# EAGLE design STM32F446RC_single layer V2_labelled (EAGLE 9.2.0)
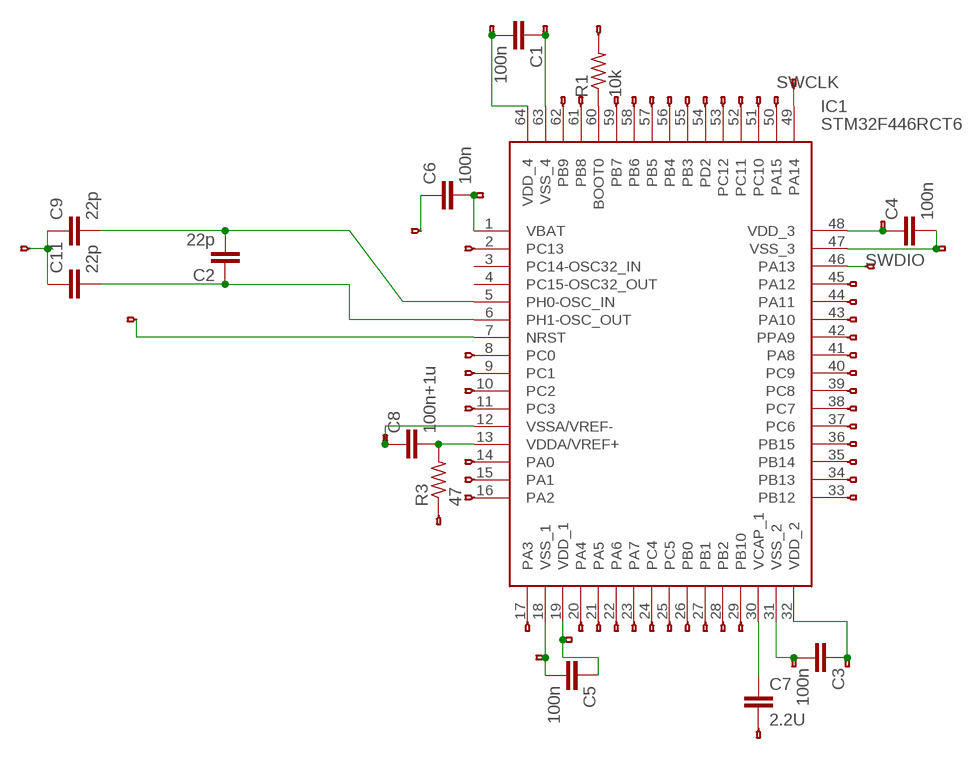
[diagram p0: schematic, sheet 1]

## Parts
C1  100n  C2,5-3  [C2.5-3]
C2  22p  C2,5-3  [C2.5-3]
C3  100n  C2,5-3  [C2.5-3]
C4  100n  C2,5-3  [C2.5-3]
C5  100n  C2,5-3  [C2.5-3]
C6  100n  C2,5-3  [C2.5-3]
C7  2.2U  C2,5-3  [C2.5-3]
C8  100n+1u  C2,5-3  [C2.5-3]
C9  22p  C2,5-3  [C2.5-3]
C11  22p  C2,5-3  [C2.5-3]
IC1  STM32F446RCT6  [QFP50P1200X1200X160-64N]
JP1  HEADERHOLE-HEADERHOLE  [1X1-HEADER-HOLE]
JP2  HEADERHOLE-HEADERHOLE  [1X1-HEADER-HOLE]
JP3  HEADERHOLE-HEADERHOLE  [1X1-HEADER-HOLE]
JP4  HEADERHOLE-HEADERHOLE  [1X1-HEADER-HOLE]
JP5  HEADERHOLE-HEADERHOLE  [1X1-HEADER-HOLE]
JP6  HEADERHOLE-HEADERHOLE  [1X1-HEADER-HOLE]
JP7  HEADERHOLE-HEADERHOLE  [1X1-HEADER-HOLE]
JP9  HEADERHOLE-HEADERHOLE  [1X1-HEADER-HOLE]
JP10  HEADERHOLE-HEADERHOLE  [1X1-HEADER-HOLE]
JP11  HEADERHOLE-HEADERHOLE  [1X1-HEADER-HOLE]
JP12  HEADERHOLE-HEADERHOLE  [1X1-HEADER-HOLE]
JP13  HEADERHOLE-HEADERHOLE  [1X1-HEADER-HOLE]
JP14  HEADERHOLE-HEADERHOLE  [1X1-HEADER-HOLE]
JP15  HEADERHOLE-HEADERHOLE  [1X1-HEADER-HOLE]
JP16  HEADERHOLE-HEADERHOLE  [1X1-HEADER-HOLE]
JP17  HEADERHOLE-HEADERHOLE  [1X1-HEADER-HOLE]
JP18  HEADERHOLE-HEADERHOLE  [1X1-HEADER-HOLE]
JP19  HEADERHOLE-HEADERHOLE  [1X1-HEADER-HOLE]
JP20  HEADERHOLE-HEADERHOLE  [1X1-HEADER-HOLE]
JP21  HEADERHOLE-HEADERHOLE  [1X1-HEADER-HOLE]
JP22  HEADERHOLE-HEADERHOLE  [1X1-HEADER-HOLE]
JP23  HEADERHOLE-HEADERHOLE  [1X1-HEADER-HOLE]
JP24  HEADERHOLE-HEADERHOLE  [1X1-HEADER-HOLE]
JP25  HEADERHOLE-HEADERHOLE  [1X1-HEADER-HOLE]
JP26  HEADERHOLE-HEADERHOLE  [1X1-HEADER-HOLE]
JP27  HEADERHOLE-HEADERHOLE  [1X1-HEADER-HOLE]
JP28  HEADERHOLE-HEADERHOLE  [1X1-HEADER-HOLE]
JP29  HEADERHOLE-HEADERHOLE  [1X1-HEADER-HOLE]
JP30  HEADERHOLE-HEADERHOLE  [1X1-HEADER-HOLE]
JP31  HEADERHOLE-HEADERHOLE  [1X1-HEADER-HOLE]
JP32  HEADERHOLE-HEADERHOLE  [1X1-HEADER-HOLE]
JP33  HEADERHOLE-HEADERHOLE  [1X1-HEADER-HOLE]
JP34  HEADERHOLE-HEADERHOLE  [1X1-HEADER-HOLE]
JP35  HEADERHOLE-HEADERHOLE  [1X1-HEADER-HOLE]
JP36  HEADERHOLE-HEADERHOLE  [1X1-HEADER-HOLE]
JP37  HEADERHOLE-HEADERHOLE  [1X1-HEADER-HOLE]
JP38  HEADERHOLE-HEADERHOLE  [1X1-HEADER-HOLE]
JP39  HEADERHOLE-HEADERHOLE  [1X1-HEADER-HOLE]
JP40  HEADERHOLE-HEADERHOLE  [1X1-HEADER-HOLE]
JP41  HEADERHOLE-HEADERHOLE  [1X1-HEADER-HOLE]
JP42  HEADERHOLE-HEADERHOLE  [1X1-HEADER-HOLE]
JP43  HEADERHOLE-HEADERHOLE  [1X1-HEADER-HOLE]
JP44  HEADERHOLE-HEADERHOLE  [1X1-HEADER-HOLE]
JP45  HEADERHOLE-HEADERHOLE  [1X1-HEADER-HOLE]
JP46  HEADERHOLE-HEADERHOLE  [1X1-HEADER-HOLE]
JP47  HEADERHOLE-HEADERHOLE  [1X1-HEADER-HOLE]
JP48  HEADERHOLE-HEADERHOLE  [1X1-HEADER-HOLE]
JP49  HEADERHOLE-HEADERHOLE  [1X1-HEADER-HOLE]
JP50  HEADERHOLE-HEADERHOLE  [1X1-HEADER-HOLE]
JP51  HEADERHOLE-HEADERHOLE  [1X1-HEADER-HOLE]
JP52  HEADERHOLE-HEADERHOLE  [1X1-HEADER-HOLE]
JP53  HEADERHOLE-HEADERHOLE  [1X1-HEADER-HOLE]
JP54  HEADERHOLE-HEADERHOLE  [1X1-HEADER-HOLE]
JP55  HEADERHOLE-HEADERHOLE  [1X1-HEADER-HOLE]
JP56  HEADERHOLE-HEADERHOLE  [1X1-HEADER-HOLE]
JP57  HEADERHOLE-HEADERHOLE  [1X1-HEADER-HOLE]
JP58  HEADERHOLE-HEADERHOLE  [1X1-HEADER-HOLE]
JP59  HEADERHOLE-HEADERHOLE  [1X1-HEADER-HOLE]
JP61  HEADERHOLE-HEADERHOLE  [1X1-HEADER-HOLE]
JP62  HEADERHOLE-HEADERHOLE  [1X1-HEADER-HOLE]
JP63  HEADERHOLE-HEADERHOLE  [1X1-HEADER-HOLE]
JP65  HEADERHOLE-HEADERHOLE  [1X1-HEADER-HOLE]
R1  10k  R-US_0204/2V  [0204V]
R3  47  R-US_0204/2V  [0204V]

## Nets
N$1: C3.2 IC1.31(VSS_2) JP50.1
N$2: C8.2 IC1.13(VDDA/VREF+) R3.2
N$3: IC1.7(NRST) JP63.1
N$4: C5.2 IC1.18(VSS_1) JP20.1
N$5: IC1.60(BOOT0) R1.1
N$6: C1.2 IC1.64(VDD_4) JP58.1
N$7: C2.1 C11.2 IC1.6(PH1-OSC_OUT)
N$8: C1.1 IC1.63(VSS_4) JP57.1
N$9: IC1.59(PB7) JP43.1
N$10: IC1.58(PB6) JP42.1
N$11: IC1.24(PC4) JP12.1
N$12: IC1.25(PC5) JP23.1
N$13: IC1.26(PB0) JP22.1
N$14: IC1.27(PB1) JP17.1
N$15: IC1.28(PB2) JP16.1
N$16: IC1.29(PB10) JP14.1
N$17: IC1.23(PA7) JP11.1
N$18: IC1.22(PA6) JP9.1
N$19: IC1.21(PA5) JP19.1
N$20: IC1.17(PA3) JP24.1
N$21: IC1.33(PB12) JP18.1
N$22: IC1.34(PB13) JP13.1
N$23: IC1.35(PB14) JP6.1
N$24: IC1.36(PB15) JP10.1
N$25: IC1.37(PC6) JP1.1
N$26: IC1.16(PA2) JP36.1
N$27: IC1.15(PA1) JP35.1
N$28: IC1.14(PA0) JP34.1
N$29: IC1.11(PC3) JP4.1
N$30: IC1.10(PC2) JP3.1
N$31: IC1.9(PC1) JP27.1
N$32: IC1.8(PC0) JP29.1
N$33: IC1.2(PC13) JP26.1
N$34: IC1.38(PC7) JP15.1
N$35: IC1.39(PC8) JP2.1
N$36: IC1.40(PC9) JP30.1
N$37: IC1.41(PA8) JP28.1
N$38: IC1.42(PPA9) JP31.1
N$39: IC1.43(PA10) JP33.1
N$40: IC1.44(PA11) JP32.1
N$41: IC1.45(PA12) JP25.1
N$42: IC1.57(PB5) JP41.1
N$43: IC1.56(PB4) JP40.1
N$44: IC1.55(PB3) JP44.1
N$45: IC1.54(PD2) JP38.1
N$46: IC1.53(PC12) JP39.1
N$47: IC1.52(PC11) JP5.1
N$48: IC1.51(PC10) JP37.1
N$49: IC1.50(PA15) JP45.1
N$50: IC1.61(PB8) JP46.1
N$51: IC1.62(PB9) JP47.1
N$52: IC1.20(PA4) JP21.1
N$53: C2.2 C9.2 IC1.5(PH0-OSC_IN)
N$54: C7.2 JP49.1
N$55: C3.1 IC1.32(VDD_2) JP51.1
N$56: C4.2 IC1.47(VSS_3) JP52.1
N$57: JP56.1 R1.2
N$58: C6.2 IC1.1(VBAT) JP7.1
N$59: C8.1 IC1.12(VSSA/VREF-) JP62.1
N$60: JP61.1 R3.1
N$63: C9.1 C11.1 JP65.1
N$64: C5.1 IC1.19(VDD_1) JP48.1
N$66: C7.1 IC1.30(VCAP_1)
N$67: C6.1 JP59.1
N$89: C4.1 IC1.48(VDD_3) JP53.1
SWCLK: IC1.49(PA14) JP55.1
SWDIO: IC1.46(PA13) JP54.1
Unconnected: IC1.3(PC14-OSC32_IN) IC1.4(PC15-OSC32_OUT)

## Library data of the parts
C1-C9 C11 = capacitor-wima:C: CAPACITOR naming: grid - package width
IC1 = STM32F446RCT6:STM32F446RCT6: STMICROELECTRONICS - STM32F446RCT6 - MCU, 32BIT, CORTEX-M4, 180MHZ, LQFP-64 Source: Datasheet <https://componentsearchengine.com/Datasheets/1/STM32F446RCT6.pdf>; DESCRIPTION: STMICROELECTRONICS - STM32F446RCT6 - MCU, 32BIT, CORTEX-M4, 180MHZ, LQFP-64; HEIGHT: 1.6mm; MANUFACTURER_NAME: STMicroelectronics; MANUFACTURER_PART_NUMBER: STM32F446RCT6; MOUSER_PART_NUMBER: 511-STM32F446RCT6; MOUSER_PRICE-STOCK: https://www.mouser.com/Search/Refine.aspx?Keyword=511-STM32F446RCT6
JP1-JP7 JP9-JP59 JP61-JP63 JP65 = F405Pill:HEADERHOLE
R1 R3 = rcl:R-US_: RESISTOR, American symbol; SPICEPREFIX: R

## Board
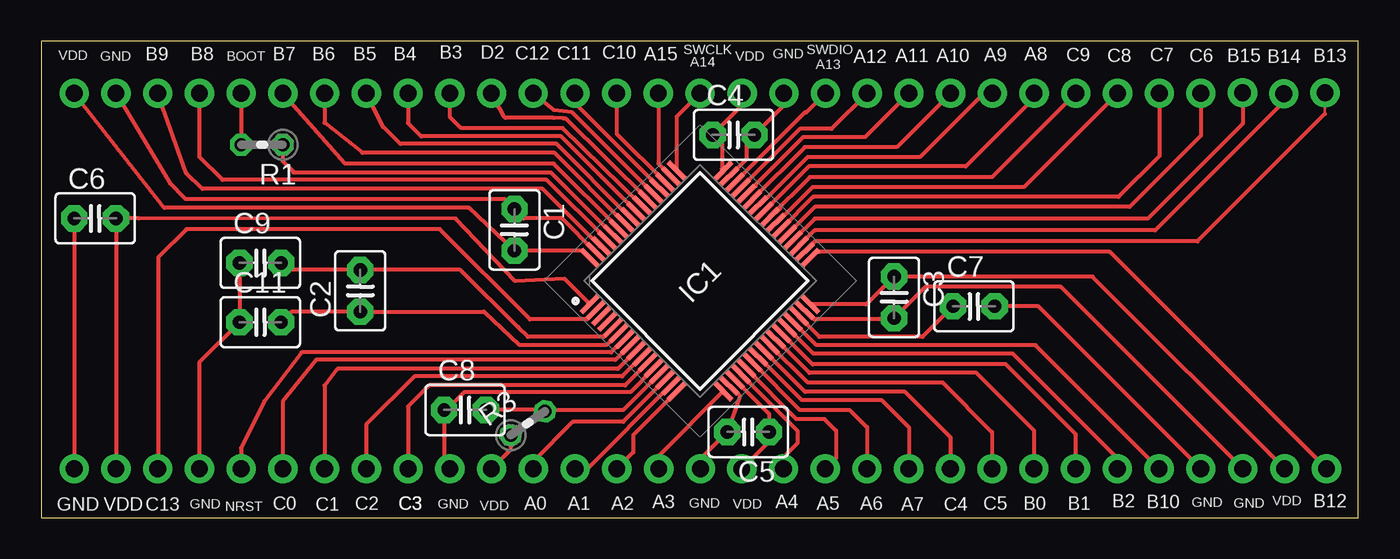
[diagram p1: board, top side]
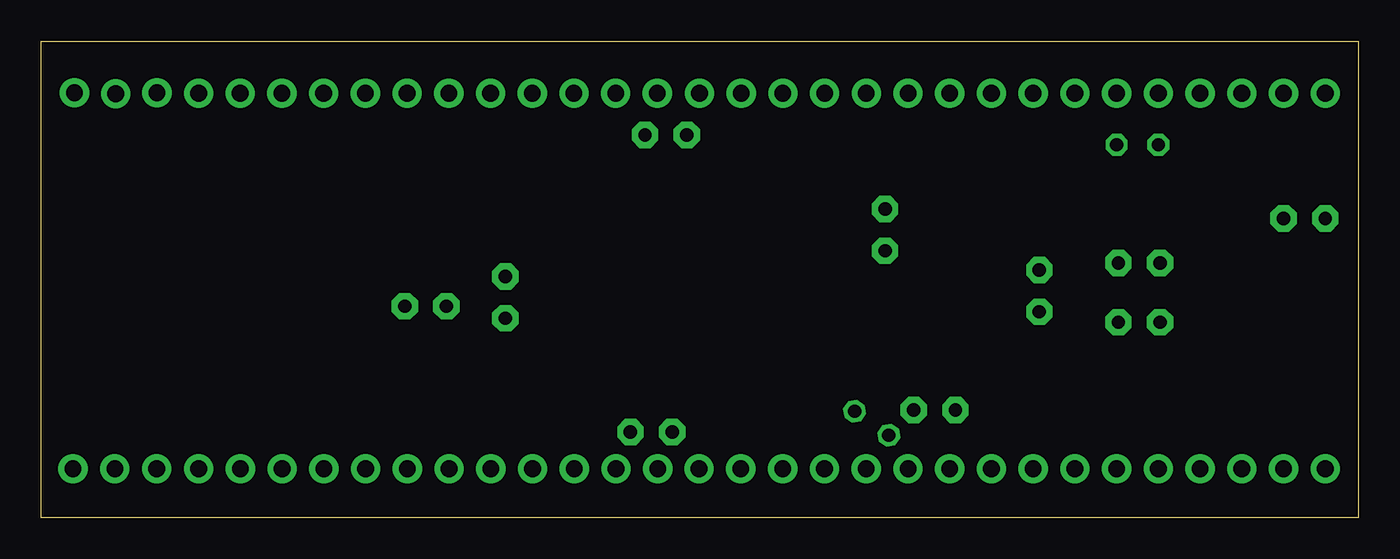
[diagram p2: board, bottom side, seen from below]

Size 80.2 x 29 mm. Coordinates in mm from the lower left corner, seen from the top.
Outline: 0,0 80.2,0 80.2,29 0,29 0,0
Copper layers (1*16): Top 0.035mm / dielectric 1.5mm / Bottom 0.035mm
Design rules "default": minimum track width 6mil, minimum drill 0.35mm, track to track 6mil, track to pad 6mil, pad to pad 6mil, via to via 6mil, smd to smd 6mil, copper to edge 40mil, drill to drill 6mil, minimum pad ring 10mil, minimum via ring 8mil, stop-mask expansion 4mil, vias tented up to drill 0mil, thermal gap 10mil

### Footprints (pad centres in the part's own frame; a part is rotated, then mirrored left to right if it is on the bottom)
C2.5-3 = drill 0.813 pad 1.6 octagon: 1 -1.27,0; 2 1.27,0
QFP50P1200X1200X160-64N = smd 1.475 x 0.3: 1 -5.738,3.75; 2 -5.738,3.25; 3 -5.738,2.75; 4 -5.738,2.25; 5 -5.738,1.75; 6 -5.738,1.25; 7 -5.738,0.75; 8 -5.738,0.25; 9 -5.738,-0.25; 10 -5.738,-0.75; 11 -5.738,-1.25; 12 -5.738,-1.75; 13 -5.738,-2.25; 14 -5.738,-2.75; 15 -5.738,-3.25; 16 -5.738,-3.75; 33 5.738,-3.75; 34 5.738,-3.25; 35 5.738,-2.75; 36 5.738,-2.25; 37 5.738,-1.75; 38 5.738,-1.25; 39 5.738,-0.75; 40 5.738,-0.25; 41 5.738,0.25; 42 5.738,0.75; 43 5.738,1.25; 44 5.738,1.75; 45 5.738,2.25; 46 5.738,2.75; 47 5.738,3.25; 48 5.738,3.75 | smd 0.3 x 1.475: 17 -3.75,-5.738; 18 -3.25,-5.738; 19 -2.75,-5.738; 20 -2.25,-5.738; 21 -1.75,-5.738; 22 -1.25,-5.738; 23 -0.75,-5.738; 24 -0.25,-5.738; 25 0.25,-5.738; 26 0.75,-5.738; 27 1.25,-5.738; 28 1.75,-5.738; 29 2.25,-5.738; 30 2.75,-5.738; 31 3.25,-5.738; 32 3.75,-5.738; 49 3.75,5.738; 50 3.25,5.738; 51 2.75,5.738; 52 2.25,5.738; 53 1.75,5.738; 54 1.25,5.738; 55 0.75,5.738; 56 0.25,5.738; 57 -0.25,5.738; 58 -0.75,5.738; 59 -1.25,5.738; 60 -1.75,5.738; 61 -2.25,5.738; 62 -2.75,5.738; 63 -3.25,5.738; 64 -3.75,5.738
1X1-HEADER-HOLE = drill 1.016 pad 1.778: 1 0,0
0204V = drill 0.813 octagon: 1 -1.27,0; 2 1.27,0

### Placement (x,y rotation side)
C1  28.82,17.51 270 top
C2  19.43,13.8 90 top
C3  51.93,13.4 270 top
C4  42.16,23.29 0 top
C5  43.05,5.21 180 top
C6  3.29,18.21 0 top
C7  56.79,12.86 0 top
C8  25.81,6.55 0 top
C9  13.35,15.5 0 top
C11  13.35,11.89 0 top
IC1  40.12,14.4 45 top
JP1  70.6,25.83 0 top
JP2  65.54,25.83 0 top
JP3  19.8,2.97 0 top
JP4  22.34,2.97 0 top
JP5  32.5,25.83 0 top
JP6  75.66,25.79 0 top
JP7  4.56,2.97 0 top
JP9  50.28,2.97 0 top
JP10  73.15,25.85 0 top
JP11  52.82,2.97 0 top
JP12  55.36,2.97 0 top
JP13  78.16,25.85 0 top
JP14  68.06,2.97 0 top
JP15  68.08,25.83 0 top
JP16  65.52,2.97 0 top
JP17  62.98,2.97 0 top
JP18  78.26,2.97 0 top
JP19  47.74,2.97 0 top
JP20  40.15,2.97 0 top
JP21  45.2,2.97 0 top
JP22  60.44,2.97 0 top
JP23  57.9,2.97 0 top
JP24  37.61,2.97 0 top
JP25  50.3,25.83 0 top
JP26  7.1,2.97 0 top
JP27  17.26,2.97 0 top
JP28  60.46,25.83 0 top
JP29  14.72,2.97 0 top
JP30  63,25.83 0 top
JP31  57.92,25.83 0 top
JP32  52.84,25.83 0 top
JP33  55.38,25.83 0 top
JP34  29.97,2.97 0 top
JP35  32.51,2.97 0 top
JP36  35.05,2.97 0 top
JP37  35.04,25.83 0 top
JP38  27.42,25.83 0 top
JP39  29.96,25.83 0 top
JP40  22.34,25.83 0 top
JP41  19.8,25.83 0 top
JP42  17.26,25.83 0 top
JP43  14.72,25.83 0 top
JP44  24.88,25.83 0 top
JP45  37.58,25.83 0 top
JP46  9.64,25.83 0 top
JP47  7.1,25.83 0 top
JP48  42.66,2.97 0 top
JP49  70.61,2.97 0 top
JP50  73.16,2.97 0 top
JP51  75.71,2.97 0 top
JP52  45.22,25.83 0 top
JP53  42.68,25.83 0 top
JP54  47.76,25.83 0 top
JP55  40.12,25.83 90 top
JP56  12.18,25.83 0 top
JP57  4.56,25.83 0 top
JP58  2.02,25.83 0 top
JP59  2.02,2.97 0 top
JP61  27.42,2.97 0 top
JP62  24.88,2.97 0 top
JP63  12.18,2.97 0 top
JP65  9.64,2.97 0 top
R1  13.45,22.69 180 top
R3  29.63,5.74 35 top

### Tracks (layer width: path | path; a pad name or v marks a point on that pad's centre or on a via)
N$1
  Top 0.152: 47.08,12.06 46.62,12.52 IC1.31 | 51.98,12.13 C3.2
  Top 0.254: JP50.1 62.08,14.05 53.85,14.05 C3.2 51.86,12.06 47.08,12.06
N$2
  Top 0.152: IC1.13 37.63,8.71
  Top 0.254: IC1.13 35.44,6.54 30.74,6.54 R3.2 30.59,6.55 C8.2 27.29,6.34
N$3
  Top 0.152: IC1.7 35.5,10.84
  Top 0.254: JP63.1 12.18,4.24 13.61,7.1 15.86,10.05 34.71,10.05 IC1.7
N$4
  Top 0.254: IC1.18 41.9,8.04 42.54,7.41 C5.2 40.15,3.58 JP20.1
N$5
  Top 0.152: IC1.60 34.73,17.25
  Top 0.254: R1.1 14.72,21.7 15.35,21.07 15.35,21 31.05,21 IC1.60
N$6
  Top 0.152: IC1.64 33.36,15.72 | 28.82,16.29 C1.2
  Top 0.254: JP58.1 7.5,18.85 26.05,18.85 C1.2 32.94,16.24 32.99,16.23 IC1.64
  Bottom 0.152: 2.12,25.73 JP58.1 | 28.82,16.29 C1.2
N$7
  Top 0.254: 26.99,12.5 29.14,10.5 34.41,10.5 35.01,11.01 IC1.6 | 26.99,12.5 26.96,12.53 | 26.99,12.5 19.46,12.5 C2.1 15.26,12.53 C11.2
N$8
  Top 0.152: IC1.63 33.67,16.18 | 28.82,18.73 C1.1 28.82,18.88
  Top 0.254: IC1.63 31.71,18.21 29.39,18.21 C1.1 28.22,19.38 8.81,19.38 7.85,20.34 JP57.1
N$9
  Top 0.152: IC1.59 35.04,17.7
  Top 0.254: JP43.1 18.5,21.54 31.21,21.54 IC1.59
N$10
  Top 0.152: IC1.58 35.5,18.01
  Top 0.254: JP42.1 17.26,24.03 19.56,22.2 31.26,22.2 IC1.58
N$11
  Top 0.254: IC1.24 46.52,7.65 52.6,7.65 55.36,4.89 JP12.1
N$12
  Top 0.254: IC1.25 46.69,8.21 54.9,8.21 57.9,5.21 JP23.1
N$13
  Top 0.254: IC1.26 46.77,8.81 56.95,8.81 60.44,5.32 JP22.1
N$14
  Top 0.152: 45.1,11.15 IC1.27
  Top 0.254: IC1.27 46.97,9.32 58.75,9.32 62.98,5.09 JP17.1
N$15
  Top 0.152: 45.56,11.45 IC1.28
  Top 0.254: IC1.28 47.01,9.98 59.15,9.98 65.52,3.61 JP16.1
N$16
  Top 0.152: 45.86,11.91 IC1.29
  Top 0.254: IC1.29 47.21,10.49 60.54,10.49 JP14.1
N$17
  Top 0.152: 43.73,9.78 IC1.23
  Top 0.254: IC1.23 46.32,7.14 51.18,7.14 52.82,5.5 JP11.1
N$18
  Top 0.152: 43.42,9.32 IC1.22
  Top 0.254: 43.42,9.32 46.2,6.54 49.24,6.54 50.28,5.5 JP9.1
N$19
  Top 0.152: 42.97,9.02 IC1.21
  Top 0.254: JP19.1 48.4,3.63 48.4,5.3 47.7,6 45.98,6 42.97,9.02
N$20
  Top 0.152: IC1.17 41.44,7.64
  Top 0.254: IC1.17 37.61,3.77 JP24.1
N$21
  Top 0.152: 47.36,16.17 IC1.33
  Top 0.254: JP18.1 65.06,16.17 47.36,16.17
N$22
  Top 0.152: IC1.34 46.64,16.32 46.64,16.34 | JP13.1 78.16,24.57
  Top 0.254: IC1.34 47.13,16.81 70.4,16.81 78.16,24.57
N$23
  Top 0.152: 46.22,16.64 IC1.35
  Top 0.254: IC1.35 47.09,17.48 67.83,17.48 75.66,25.31 JP6.1
N$24
  Top 0.152: 45.86,16.94 IC1.36
  Top 0.254: IC1.36 47.1,18.2 67.38,18.2 73.15,23.97 JP10.1
N$25
  Top 0.152: 45.56,17.25 IC1.37
  Top 0.254: IC1.37 47.1,18.91 66.28,18.91 70.6,23.23 JP1.1
N$26
  Top 0.254: IC1.16 36.05,5.03 36.05,3.97 JP36.1
N$27
  Top 0.152: IC1.15 38.24,7.95
  Top 0.254: 38.24,7.95 33.26,2.97 JP35.1
N$28
  Top 0.152: IC1.14 38.01,8.37 37.97,8.36
  Top 0.254: 37.97,8.36 35.44,5.82 32.37,5.82 29.97,3.42 JP34.1
N$29
  Top 0.254: IC1.11 35.81,8.32 35.56,8.05 23.62,8.05 22.34,6.77 JP4.1
N$30
  Top 0.152: 36.72,9.93 IC1.10
  Top 0.254: IC1.10 35.38,8.6 22.73,8.6 19.8,5.67 JP3.1
  Bottom 0.152: 19.8,3.07 JP3.1
N$31
  Top 0.152: IC1.9 36.11,10.08
  Top 0.254: IC1.9 35.18,9.11 35.11,9.05 18.03,9.05 17.26,8.05 JP27.1
N$32
  Top 0.254: JP29.1 14.72,7.07 16.73,9.6 34.97,9.6 IC1.8
N$33
  Top 0.152: IC1.2 33.67,12.52
  Top 0.254: 33.67,12.52 33.21,12.06 29.76,12.06 24.27,17.55 8.85,17.55 7.13,15.83 7.13,3 JP26.1
N$34
  Top 0.152: 45.1,17.7 IC1.38
  Top 0.254: IC1.38 47,19.51 65.59,19.51 68.08,22 JP15.1
N$35
  Top 0.152: 44.79,18.01 IC1.39
  Top 0.254: IC1.39 45.21,18.43 45.28,18.43 46.97,20.12 59.83,20.12 JP2.1
N$36
  Top 0.152: 44.73,18.55 44.49,18.31 IC1.40 44.8,18.75 44.86,18.69
  Top 0.254: 45.01,18.83 44.86,18.69 44.73,18.55 | IC1.40 46.8,20.73 57.9,20.73 JP30.1
N$37
  Top 0.152: 60.54,25.91 JP28.1
  Top 0.254: IC1.41 46.75,21.38 56.3,21.38 60.46,25.54 JP28.1
N$38
  Top 0.254: IC1.42 44.15,19.49 44.22,19.49 46.67,21.94 53.5,21.94 57.39,25.83 JP31.1
N$39
  Top 0.152: IC1.43 43.27,19.23
  Top 0.254: IC1.43 46.5,22.54 52.09,22.54 JP33.1
  Bottom 0.152: JP33.1 55.38,25.78
N$40
  Top 0.254: 43.51,20.2 43.44,20.2 IC1.44 46.4,23.15 50.16,23.15 JP32.1
N$41
  Top 0.254: JP25.1 48.13,23.66 46.2,23.66 IC1.45
N$42
  Top 0.152: IC1.57 35.8,18.31
  Top 0.254: JP41.1 20.82,23.79 21.87,22.74 31.37,22.74 35.8,18.31
N$43
  Top 0.152: IC1.56 36.11,18.77
  Top 0.254: JP40.1 22.34,24 23.14,23.2 31.66,23.2 35.21,19.66 35.21,19.65 36.16,18.73 IC1.56
N$44
  Top 0.152: IC1.55 36.56,19.07
  Top 0.254: JP44.1 24.88,24.4 25.58,23.7 31.76,23.7 IC1.55
N$45
  Top 0.152: IC1.54 36.87,19.38 | 31.88,24.28 31.8,24.25 31.8,24.3
  Top 0.254: JP38.1 28.18,24.4 28.26,24.32 31.2,24.32 31.8,24.3 31.83,24.3 | IC1.54 31.95,24.28 31.88,24.28
N$46
  Top 0.152: IC1.53 37.17,19.84
  Top 0.254: JP39.1 31.23,24.8 32.33,24.66 IC1.53
N$47
  Top 0.152: IC1.52 37.65,20.07
  Top 0.254: 37.65,20.07 32.5,25.22 JP5.1
N$48
  Top 0.152: IC1.51 37.94,20.45
  Top 0.254: IC1.51 35.04,23.37 JP37.1
N$49
  Top 0.254: JP45.1 37.58,21.54 IC1.50
N$50
  Top 0.152: IC1.61 34.43,16.94
  Top 0.254: IC1.61 30.79,20.55 11.05,20.55 9.64,21.96 JP46.1
N$51
  Top 0.254: JP47.1 8.85,20.96 9.81,20 30.53,20 34.02,16.51 IC1.62
N$52
  Top 0.152: 42.66,8.71 IC1.20
  Top 0.254: IC1.20 45.34,5.99 46.04,5.29 46.04,4.51 45.2,3.67 JP21.1
N$53
  Top 0.152: IC1.5 34.73,11.45
  Top 0.254: IC1.5 34.24,11 29.64,11 29.05,11.59 25.52,15.07 C2.2 15.05,15.07 C9.2
N$54
  Top 0.254: JP49.1 60.72,12.86 C7.2
  Bottom 0.152: JP49.1 70.56,3.07
N$55
  Top 0.152: 46.93,12.98 IC1.32
  Top 0.254: 46.93,12.98 50.24,12.98 C3.1 64.01,14.67 JP51.1
N$56
  Top 0.254: IC1.47 42.93,21.81 42.93,22.79 C4.2 45.22,25.08 JP52.1
N$57
  Top 0.254: JP56.1 R1.2
  Bottom 0.152: 12.28,25.78 JP56.1
N$58
  Top 0.152: IC1.1 33.36,13.13
  Top 0.254: IC1.1 31.88,14.53 28.86,14.39 25.24,18.2 5.95,18.21 C6.2 JP7.1
N$59
  Top 0.152: 37.17,9.02 IC1.12 37.27,9.11
  Top 0.254: IC1.12 37.22,9.03 37.22,8.99 35.87,7.64 25.76,7.64 24.68,6.55 C8.1 24.54,3.31 JP62.1
N$60
  Top 0.254: R3.1 28.59,4.14 JP61.1
N$63
  Top 0.254: C9.1 C11.1 9.64,9.45 JP65.1
N$64
  Top 0.152: 42.35,8.25 IC1.19
  Top 0.254: IC1.19 44.32,6.31 C5.1 44.61,4.92 JP48.1
N$66
  Top 0.152: 46.16,12.22 IC1.30
  Top 0.254: 46.16,12.22 47.38,11 53.66,11 C7.1
N$67
  Top 0.254: C6.1 JP59.1
N$89
  Top 0.152: IC1.48 41.44,21.21
  Top 0.254: JP53.1 42.68,25.08 C4.1 41.44,22.74 41.44,21.21
SWCLK
  Top 0.152: IC1.49 38.7,21.21
  Top 0.254: 38.7,21.21 38.7,24.41 JP55.1
SWDIO
  Top 0.254: IC1.46 46.49,24.66 46.59,24.66 JP54.1

### Text on the board
tPlace: VDD | GND | B9 | B8 | BOOT | B7 | B6 | B5 | B4 | B3 | D2 | C12 | C11 | C10 | A15 | SWCLK | VDD | GND | SWDIO | A12 | A11 | A10 | A9 | A8 | C9 | C8 | C7 | C6 | B15 | B14 | B13 | A14 | A13 | GND | GND | A3 | GND | VDD | A4 | B2 | B10 | GND | GND | VDD | B12 | GND | VDD | C13 | NRST | C0 | C1 | C2 | C3 | C3 | C3 | VDD | A0 | A1 | A2 | A5 | A6 | A7 | C4 | C5 | B0 | B1